# EAGLE design Piano2MidiMaster (EAGLE 7.6.0)
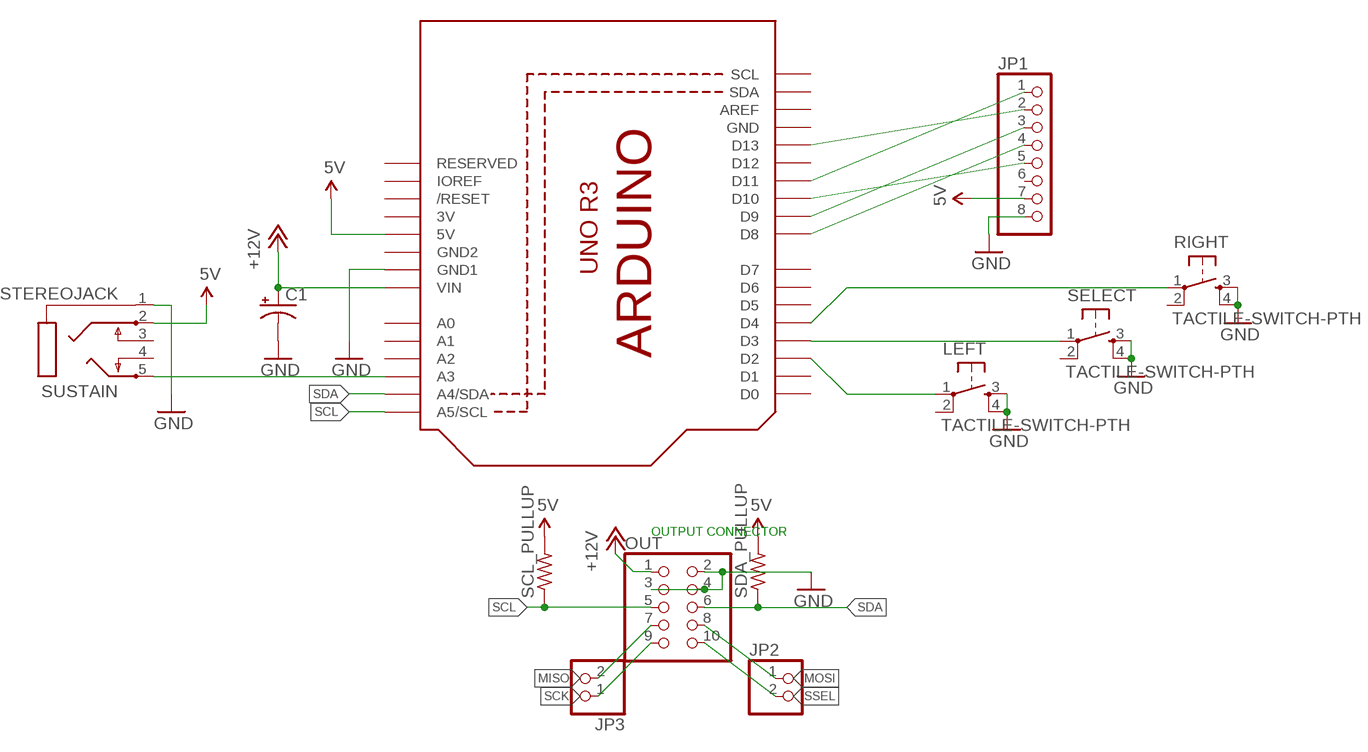
[diagram p0: schematic, sheet 1]

## Parts
C1  CPOL-USE2.5-6  [E2,5-6]
JP1  PINHD-1X8BIG  [1X08-BIG]
JP2  PINHD-1X2  [1X02]
JP3  PINHD-1X2  [1X02]
LEFT  TACTILE-SWITCH-PTH  [TAC-SWITCH-PTH]
OUT  PINHD-2X5IDC  [2X05IDC]
RIGHT  TACTILE-SWITCH-PTH  [TAC-SWITCH-PTH]
SCL_PULLUP  R-US_0207/15  [0207/15]
SDA_PULLUP  R-US_0207/12  [0207/12]
SELECT  TACTILE-SWITCH-PTH  [TAC-SWITCH-PTH]
SUSTAIN  STEREOJACK  [STX3100]
U1  ARDUINOR3-DIMENSION  [ARDUINOR3]

## Nets
5V: JP1.7 SCL_PULLUP.2 SDA_PULLUP.2 SUSTAIN.2 U1.5V
+12V: C1.+ OUT.1 U1.VIN
GND: C1.- JP1.8 LEFT.3 LEFT.4 OUT.2 OUT.3 OUT.4 RIGHT.3 RIGHT.4 SELECT.3 SELECT.4 SUSTAIN.1 U1.GND1
MISO: JP3.2 OUT.7
MOSI: JP2.1 OUT.8
N$1: JP1.1 U1.D11
N$2: JP1.2 U1.D13
N$3: JP1.3 U1.D9
N$4: JP1.4 U1.D8
N$5: JP1.5 U1.D10
N$7: LEFT.1 U1.D2
N$8: SELECT.1 U1.D3
N$9: RIGHT.1 U1.D4
N$10: SUSTAIN.5 U1.A3
SCK: JP3.1 OUT.9
SCL: OUT.5 SCL_PULLUP.1 U1.A5(A5/SCL)
SDA: OUT.6 SDA_PULLUP.1 U1.A4(A4/SDA)
SSEL: JP2.2 OUT.10
Unconnected: JP1.6 LEFT.2 RIGHT.2 SELECT.2 SUSTAIN.3 SUSTAIN.4 U1.A0 U1.A1 U1.A2 U1.AREF U1.D0 U1.D1 U1.D5 U1.D6 U1.D7 U1.D12 U1.IOREF U1.RESERVED U1.RESET(/RESET) U1.SCL U1.SDA

## Notes on the sheet
- OUTPUT CONNECTOR

## Power pins joined to a net without a drawn wire
3V: U1.3V
GND: U1.GND
GND2: U1.GND2

## Library data of the parts
C1 = adafruit:CPOL-US: POLARIZED CAPACITOR, American symbol
JP1 = adafruit:PINHD-1X8: PIN HEADER
JP2 JP3 = pinhead:PINHD-1X2: PIN HEADER
LEFT RIGHT SELECT = GeekAmmo:TACTILE-SWITCH: Tactile Switch 4 Pins, SPST NO
OUT = pinhead:PINHD-2X5: PIN HEADER
SCL_PULLUP SDA_PULLUP = editedadafruit:R-US_: RESISTOR, American symbol
SUSTAIN = adafruit:STEREOJACK: MIC/HEADPHONE JACK Stereo jack with two switches. Kycon STX3100, CUI SJ1-3555NG and/or 4UCon 05544
U1 = adafruit:ARDUINOR3: This is a new object for the new Arduino R3 - with extra pins that you may want to use (such as IOref, and duplicated A4/A5

## Board
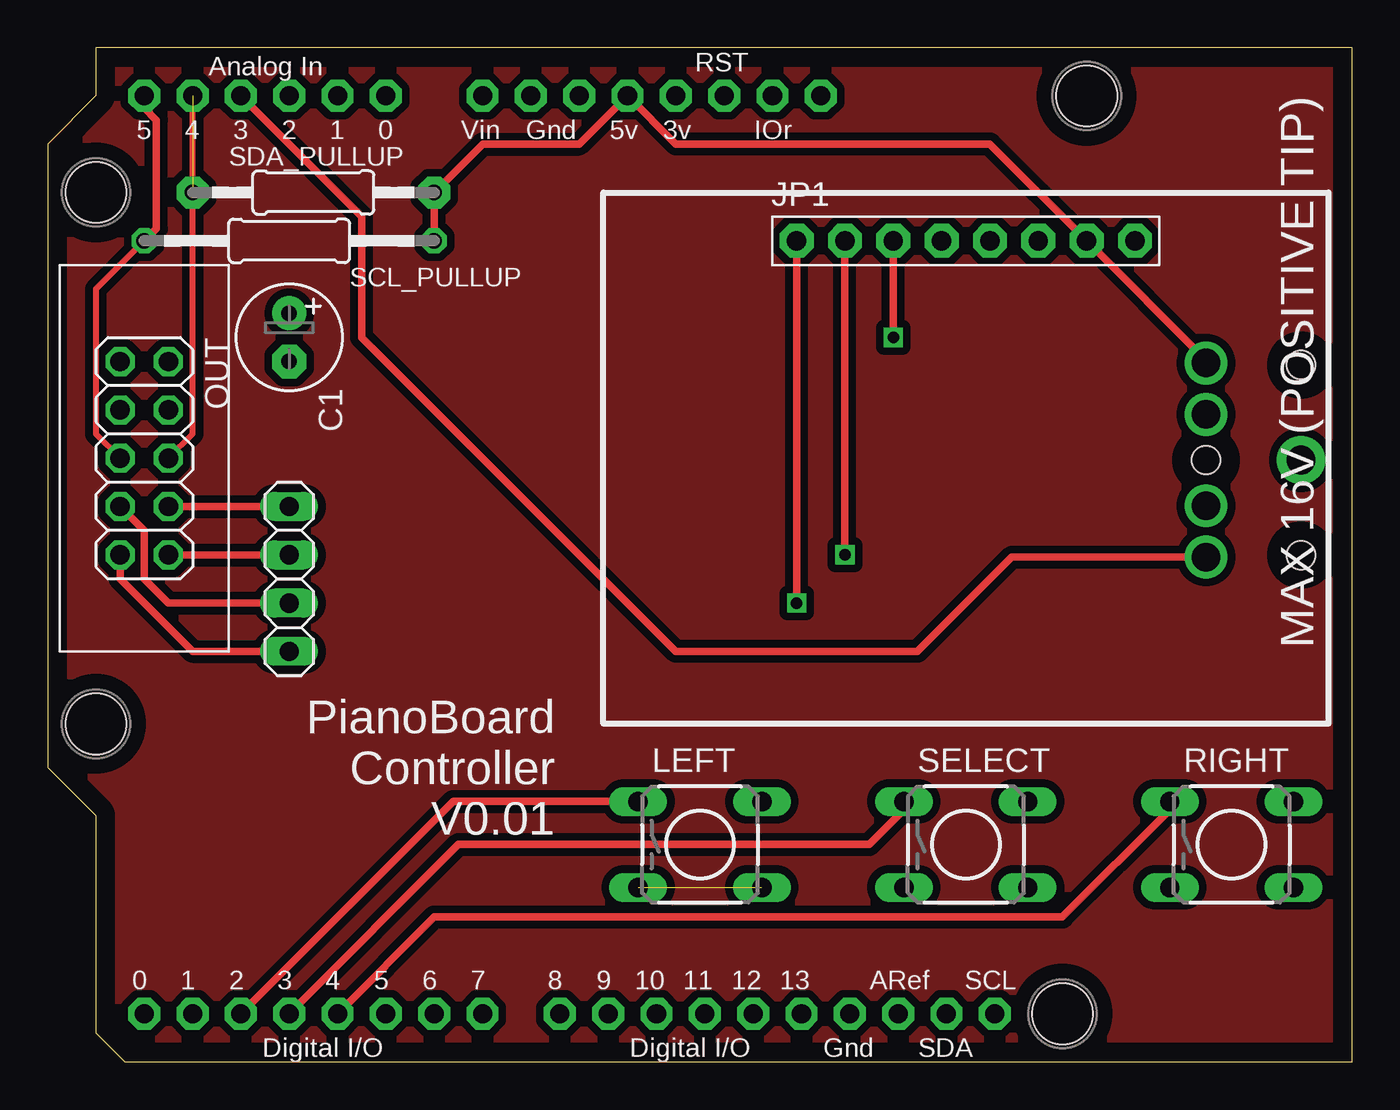
[diagram p1: board, top side]
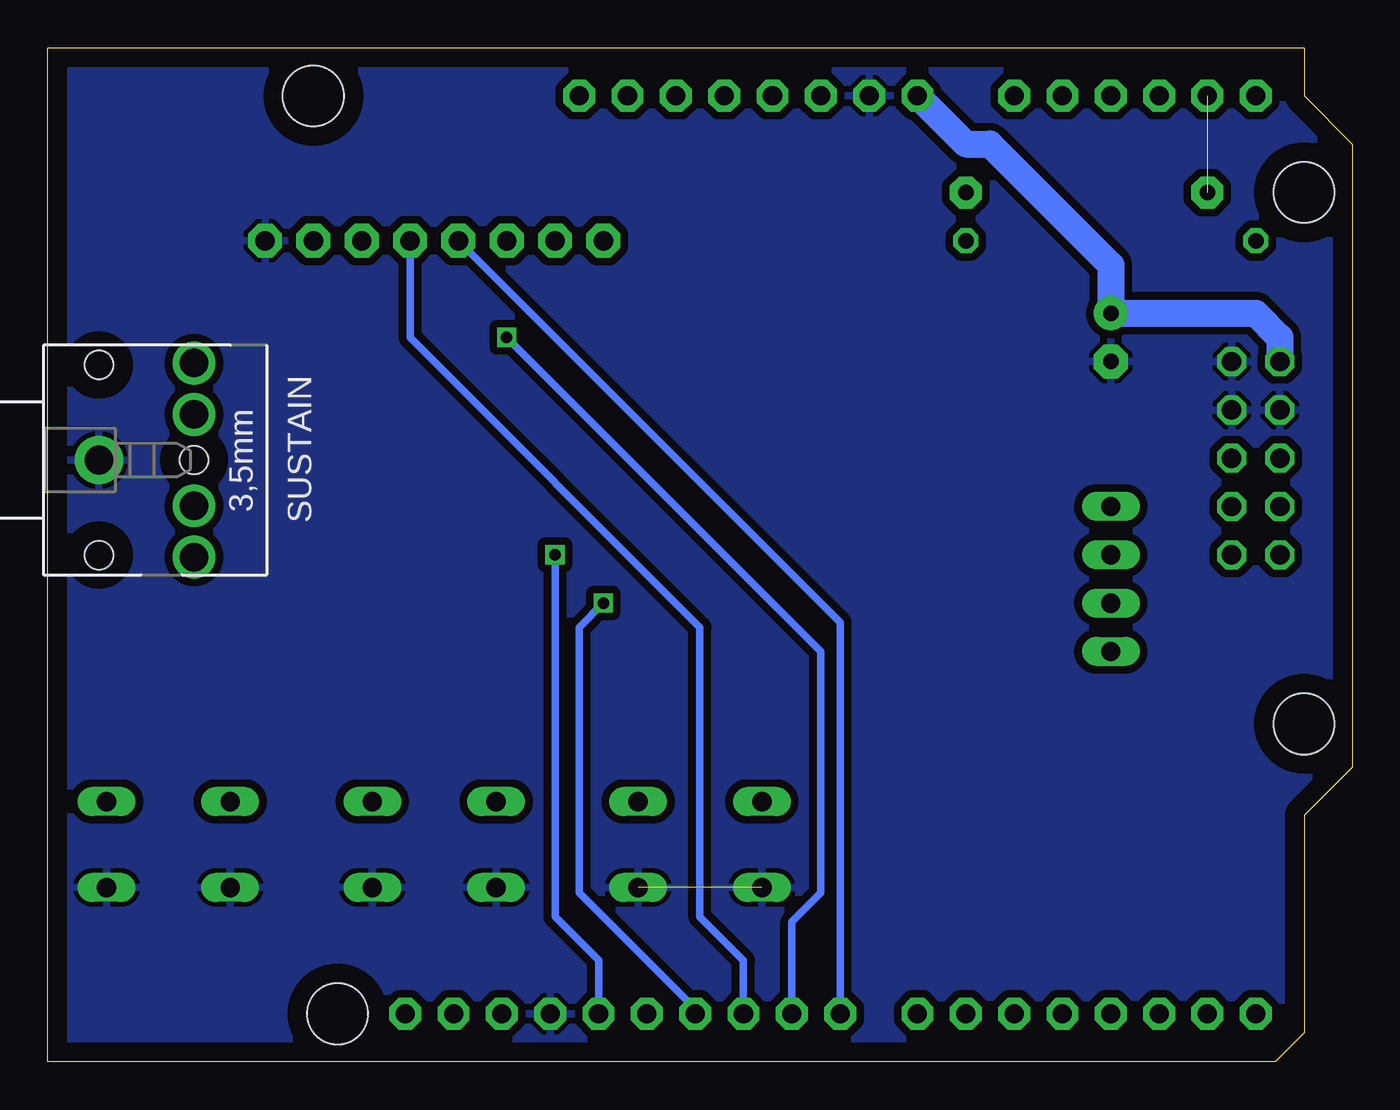
[diagram p2: board, bottom side, seen from below]

Size 68.58 x 53.34 mm. Coordinates in mm from the lower left corner, seen from the top.
Copper layers (1*16): Top 0.035mm / dielectric 1.5mm / Bottom 0.035mm
Design rules "default": minimum track width 10mil, minimum drill 24mil, track to track 8mil, track to pad 8mil, pad to pad 8mil, via to via 8mil, smd to smd 8mil, copper to edge 40mil, drill to drill 8mil, minimum pad ring 10mil, minimum via ring 8mil, stop-mask expansion 4mil, vias tented up to drill 0mil, thermal gap 10mil
Holes 3.2 mm at 53.34,2.54 54.61,50.8 2.54,45.72 2.54,17.78

### Footprints (pad centres in the part's own frame; a part is rotated, then mirrored left to right if it is on the bottom)
E2,5-6 = drill 0.813 pad 1.778: + -1.27,0 | drill 0.813 pad 1.778 octagon: - 1.27,0
1X08-BIG = drill 1.016 pad 1.778 octagon: 1 -8.89,0; 2 -6.35,0; 3 -3.81,0; 4 -1.27,0; 5 1.27,0; 6 3.81,0; 7 6.35,0; 8 8.89,0
1X02 = drill 1.016 long: 1 -1.27,0; 2 1.27,0
TAC-SWITCH-PTH = drill 1.016 pad 1.524 long: 1 -3.251,2.261; 2 3.251,2.261; 3 -3.251,-2.261; 4 3.251,-2.261
2X05IDC = drill 1.016 octagon: 1 -5.08,-1.27; 2 -5.08,1.27; 3 -2.54,-1.27; 4 -2.54,1.27; 5 0,-1.27; 6 0,1.27; 7 2.54,-1.27; 8 2.54,1.27; 9 5.08,-1.27; 10 5.08,1.27
0207/15 = drill 0.813 octagon: 1 -7.62,0; 2 7.62,0
0207/12 = drill 0.813 pad 1.676 octagon: 1 -6.35,0; 2 6.35,0
STX3100 = drill 1.5 pad 2.54: 1 2.7,-0.1 | drill 1.5: 2 7.7,5; 3 7.7,2.3; 4 7.7,-2.5; 5 7.7,-5.2 | hole 1.5: 2.7,4.9; 2.7,-5.1; 7.7,-0.1
ARDUINOR3 = drill 1 pad 1.676 octagon: 3V 35.56,2.54; 5V 38.1,2.54; A0 50.8,2.54; A1 53.34,2.54; A2 55.88,2.54; A3 58.42,2.54; A4 60.96,2.54; A5 63.5,2.54; AREF 23.876,50.8; D0 63.5,50.8; D1 60.96,50.8; D2 58.42,50.8; D3 55.88,50.8; D4 53.34,50.8; D5 50.8,50.8; D6 48.26,50.8; D7 45.72,50.8; D8 41.656,50.8; D9 39.116,50.8; D10 36.576,50.8; D11 34.036,50.8; D12 31.496,50.8; D13 28.956,50.8; GND 26.416,50.8; GND1 43.18,2.54; GND2 40.64,2.54; IOREF 30.48,2.54; RESERVED 27.94,2.54; RESET 33.02,2.54; SCL 18.796,50.8; SDA 21.336,50.8; VIN 45.72,2.54

### Placement (x,y rotation side)
C1  12.7,38.1 270 top
JP1  48.26,43.18 0 top
JP2  12.7,27.94 270 top
JP3  12.7,22.86 90 top
LEFT  34.29,11.43 0 top
OUT  5.08,31.75 270 top
RIGHT  62.23,11.43 0 top
SCL_PULLUP  12.7,43.18 0 top
SDA_PULLUP  13.97,45.72 0 top
SELECT  48.26,11.43 0 top
SUSTAIN  68.58,31.75 0 bottom
U1  68.58,53.34 180 top

### Tracks (layer width: path | path; a pad name or v marks a point on that pad's centre or on a via)
5V
  Top 0.406: SCL_PULLUP.2 SDA_PULLUP.2 22.86,48.26 27.94,48.26 U1.5V 33.02,48.26 49.53,48.26 JP1.7 60.88,36.91 SUSTAIN.2
+12V
  Bottom 1.422: OUT.1 3.81,38.1 5.08,39.37 C1.+ 12.7,41.91 19.05,48.26 20.32,48.26 U1.VIN
GND  (1 unrouted)
  pour Bottom (isolate 0.406): 68.58,0 68.58,53.34 2.54,53.34 2.54,50.8 0,48.26 0,15.24 2.54,12.7 2.54,1.27 3.81,0
MISO
  Top 0.406: OUT.7 5.08,27.94 5.08,25.4 6.35,24.13 JP3.2
MOSI
  Top 0.406: OUT.8 JP2.1
N$1  (via drill 0.6)
  Top 0.406: v39.37,24.13 JP1.1
  Bottom 0.406: U1.D11 34.54,2.79 40.64,8.89 40.64,22.86 v39.37,24.13
N$2  (via drill 0.6)
  Top 0.406: v41.91,26.67 JP1.2
  Bottom 0.406: U1.D13 39.62,5.33 41.91,7.62 v41.91,26.67
N$3  (via drill 0.6)
  Top 0.406: v44.45,38.1 JP1.3
  Bottom 0.406: U1.D9 29.46,7.37 27.94,8.89 27.94,21.59 v44.45,38.1
N$4
  Bottom 0.406: U1.D8 26.92,23.11 JP1.4
N$5
  Bottom 0.406: U1.D10 32,5.33 34.29,7.62 34.29,22.86 49.53,38.1 JP1.5
N$6
  pour Top (isolate 0.406): 0,48.26 2.54,50.8 2.54,53.34 68.58,53.34 68.58,0 3.81,0 2.54,1.27 2.54,12.7 0,15.24
N$7
  Top 0.406: U1.D2 21.31,13.69 LEFT.1
N$8
  Top 0.406: U1.D3 21.59,11.43 43.18,11.43 45.01,13.26 SELECT.1
N$9
  Top 0.406: U1.D4 20.32,7.62 53.34,7.62 58.98,13.26 RIGHT.1
N$10
  Top 0.406: U1.A3 16.51,44.45 16.51,38.1 33.02,21.59 45.72,21.59 50.68,26.55 SUSTAIN.5
SCK
  Top 0.406: OUT.9 3.81,25.4 7.62,21.59 JP3.1
SCL
  Top 0.305: SCL_PULLUP.1 2.54,40.64 2.54,33.02 OUT.5
  Top 0.406: SCL_PULLUP.1 5.71,43.81 5.71,49.53 5.08,50.16 U1.A5
SDA  (1 unrouted)
  Top 0.305: OUT.6 7.62,33.02 U1.A4
SSEL
  Top 0.406: OUT.10 JP2.2

### Text on the board
tPlace: MAX 16V (POSITIVE TIP) | PianoBoard / Controller / V0.01